# Altium schematic sheet POWER.SchDoc
size A4
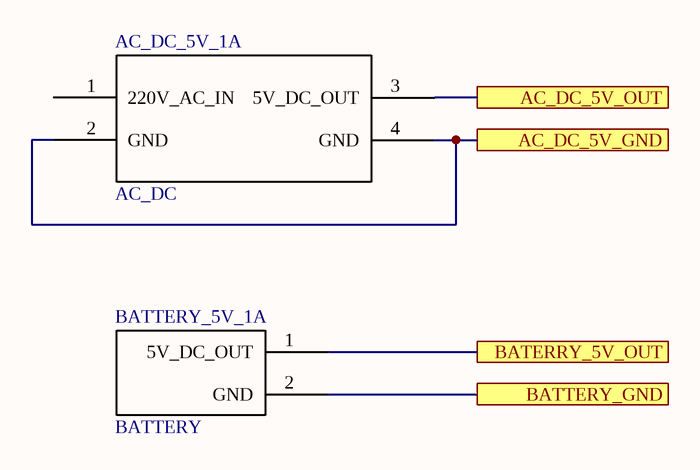
[diagram p0: POWER.SchDoc]

## Parts
AC_DC_5V_1A  AC_DC
BATTERY_5V_1A  BATTERY

## Ports
AC_DC_5V_GND, AC_DC_5V_OUT, BATERRY_5V_OUT, BATTERY_GND

## Nets
AC_DC_5V_GND: AC_DC_5V_1A.2(GND) AC_DC_5V_1A.4(GND) ; port AC_DC_5V_GND
AC_DC_5V_OUT: AC_DC_5V_1A.3(5V_DC_OUT) ; port AC_DC_5V_OUT
BATERRY_5V_OUT: BATTERY_5V_1A.1(5V_DC_OUT) ; port BATERRY_5V_OUT
BATTERY_GND: BATTERY_5V_1A.2(GND) ; port BATTERY_GND

Not connected (* = marked no-connect by the designer): AC_DC_5V_1A 1(220V_AC_IN)